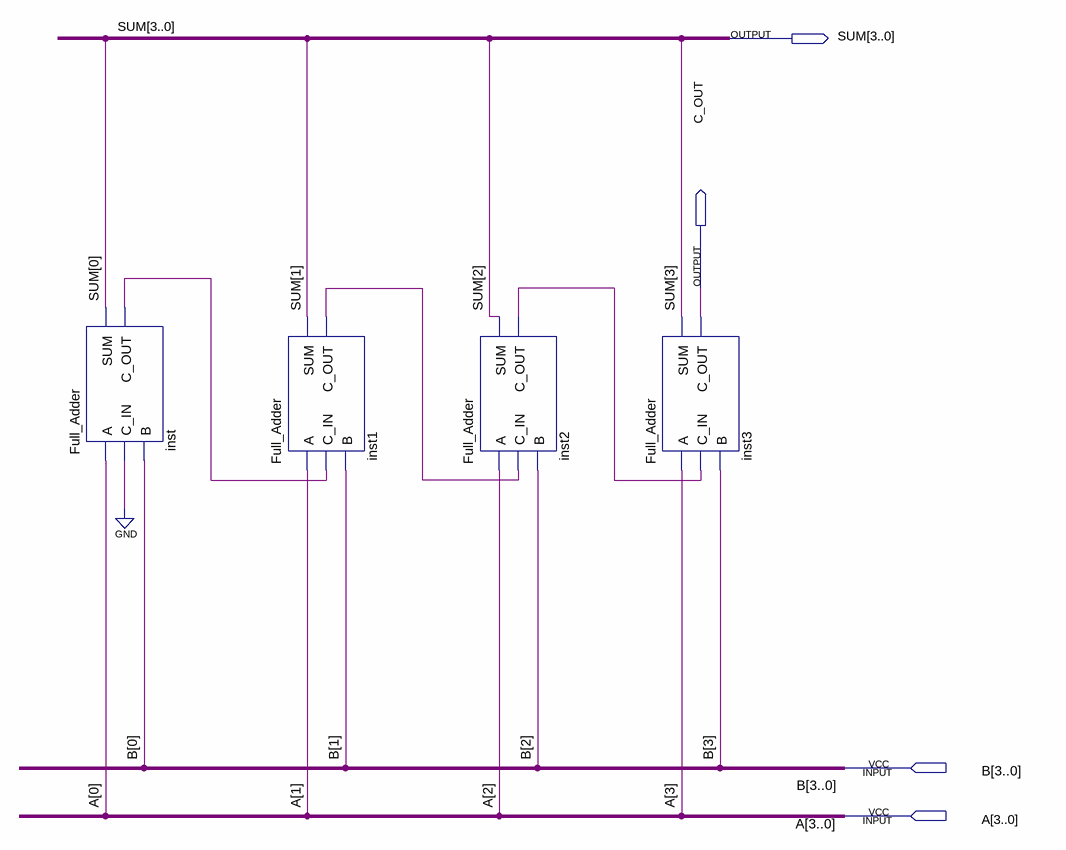
[diagram p0: schematic sheet]
// Quartus schematic Full_Adder_multi_bit.bdf as structural Verilog: 4 symbols, 4 pins
module Full_Adder_multi_bit (
  input  [3:0] B,
  input  [3:0] A,
  output [3:0] SUM,
  output C_OUT
);

  wire inst1_c_out, inst2_c_out, inst_c_out;

  Full_Adder inst (.A(A[0]), .C_IN(1'b0), .B(B[0]), .SUM(SUM[0]), .C_OUT(inst_c_out));
  Full_Adder inst1 (.A(A[1]), .C_IN(inst_c_out), .B(B[1]), .SUM(SUM[1]), .C_OUT(inst1_c_out));
  Full_Adder inst2 (.A(A[2]), .C_IN(inst1_c_out), .B(B[2]), .SUM(SUM[2]), .C_OUT(inst2_c_out));
  Full_Adder inst3 (.A(A[3]), .C_IN(inst2_c_out), .B(B[3]), .SUM(SUM[3]), .C_OUT(C_OUT));
endmodule
